# Altium schematic sheet EmergencyCaller.SchDoc
size A3
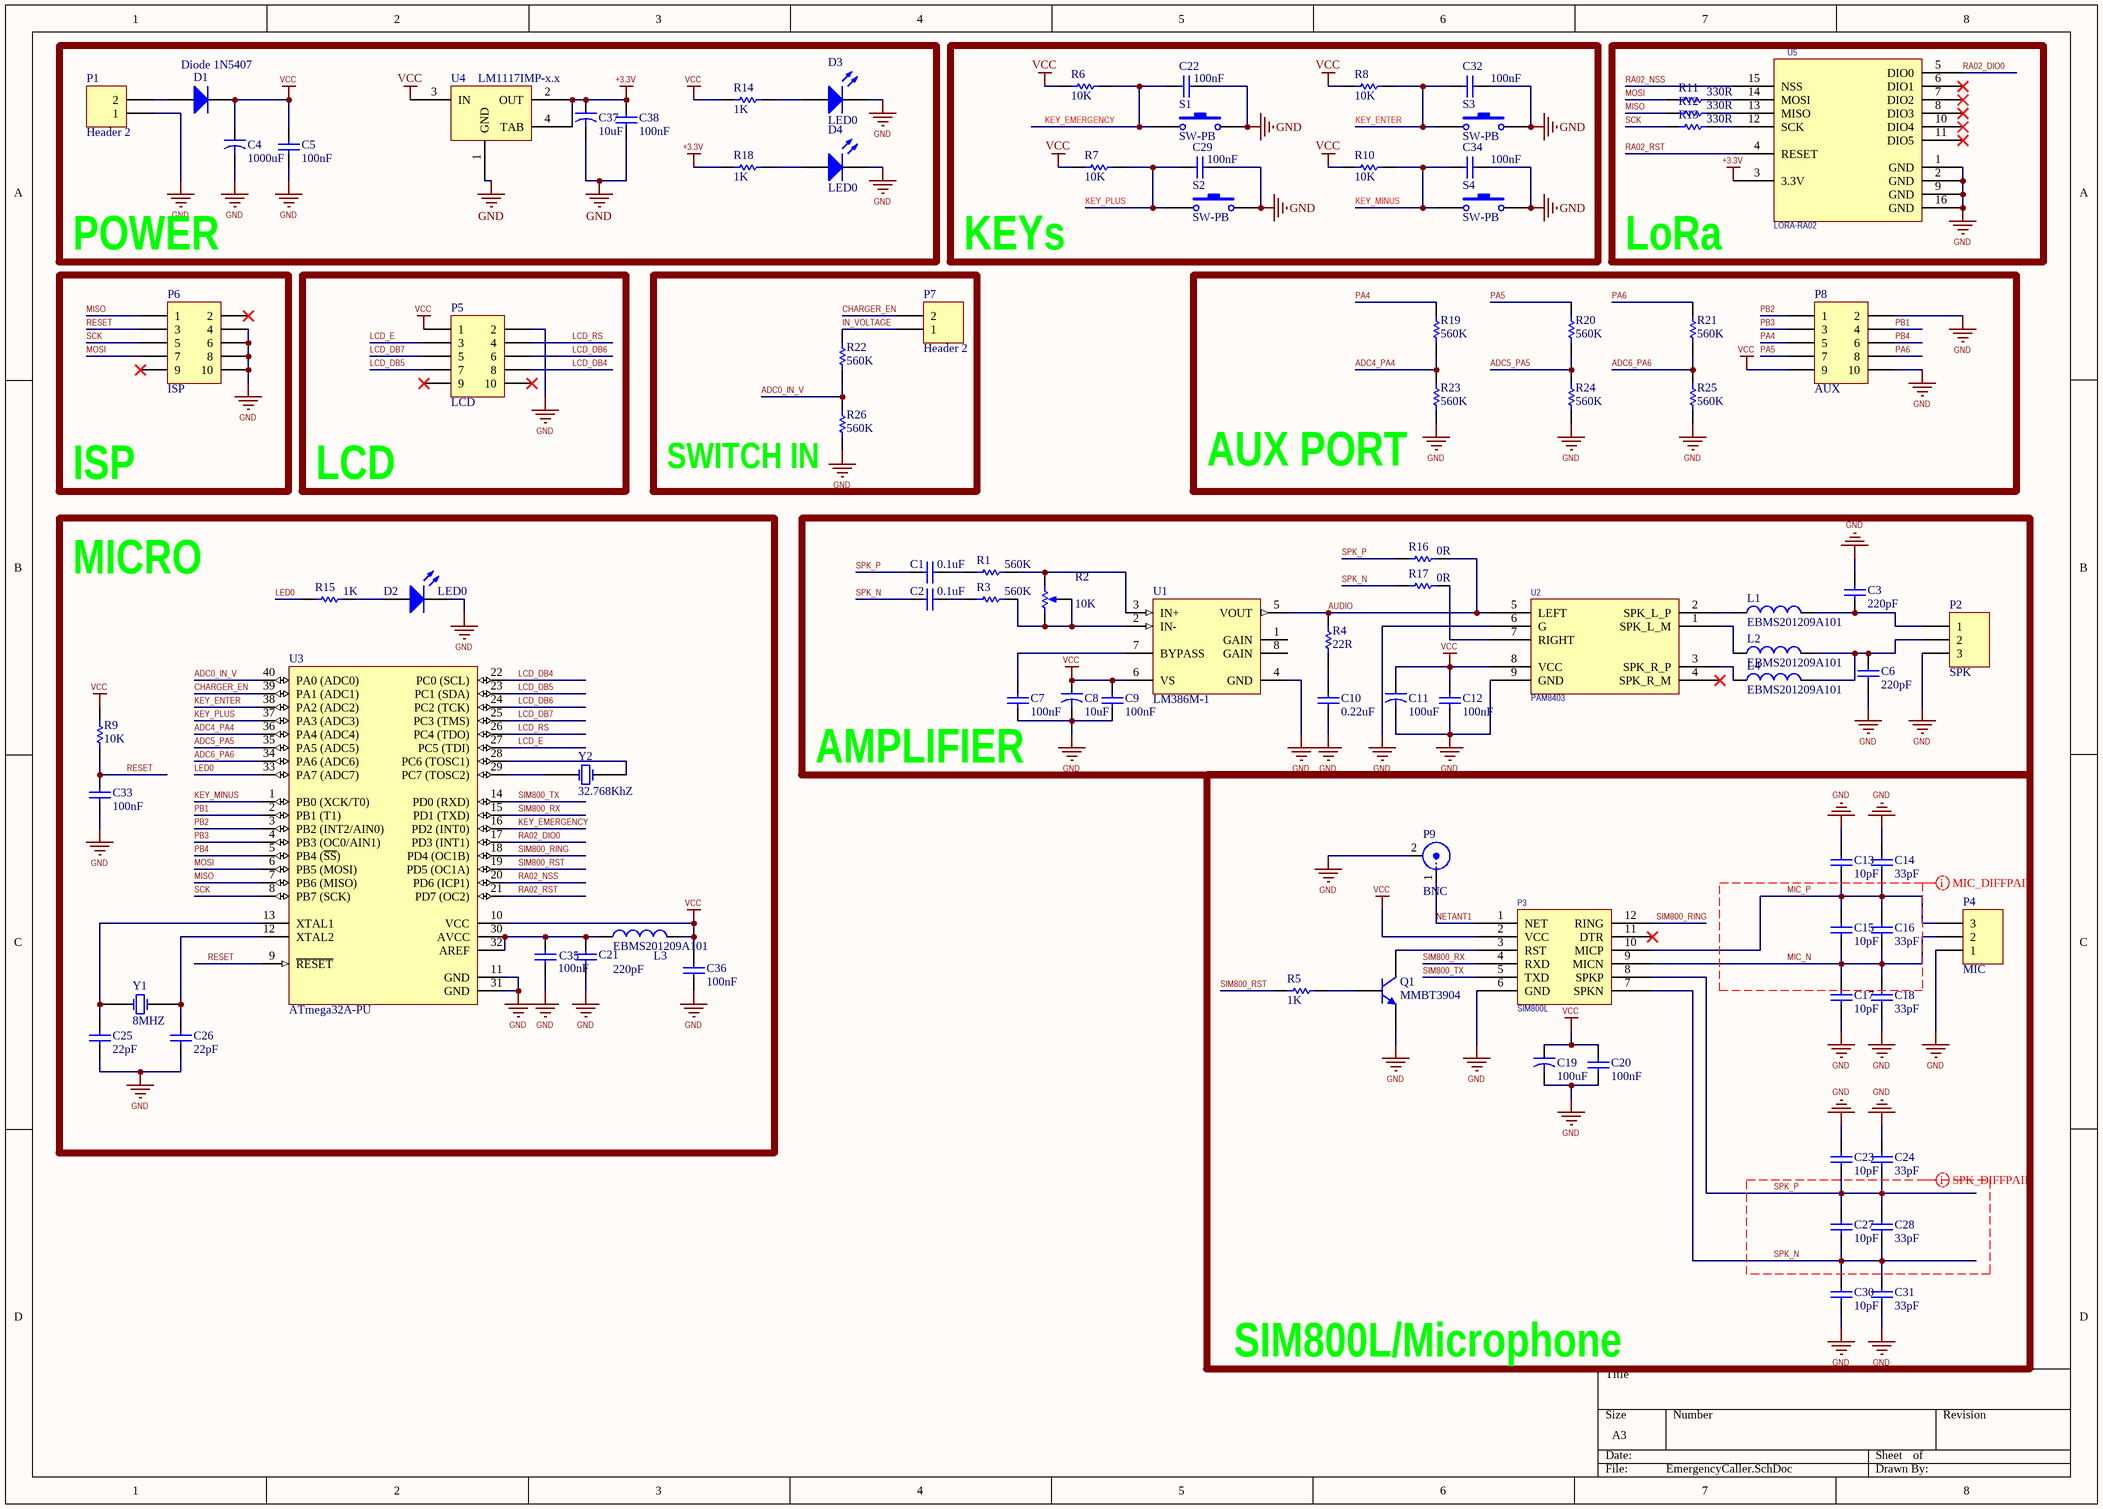
[diagram p0: EmergencyCaller.SchDoc]

## Parts
C1  0.1uF  [CAP0805]
C2  0.1uF  [CAP0805]
C3  220pF  [CAP0805]
C4  1000uF  [Cap electrolitic radial 10x16-5]
C5  100nF  [CAP0805]
C6  220pF  [CAP0805]
C7  100nF  [CAP0805]
C8  10uF  [Cap electrolitic radial 5x11-2]
C9  100nF  [CAP0805]
C10  0.22uF  [CAP0805]
C11  100uF  [Cap electrolitic radial 10x16-5]
C12  100nF  [CAP0805]
C13  10pF  [CAP0805]
C14  33pF  [CAP0805]
C15  10pF  [CAP0805]
C16  33pF  [CAP0805]
C17  10pF  [CAP0805]
C18  33pF  [CAP0805]
C19  100uF  [Cap electrolitic radial 10x16-5]
C20  100nF  [CAP0805]
C21  220pF  [CAP0805]
C22  value 100nF  [CAP0805]  (hidden comment: Cap)
C23  10pF  [CAP0805]
C24  33pF  [CAP0805]
C25  22pF  [CAP0805]
C26  22pF  [CAP0805]
C27  10pF  [CAP0805]
C28  33pF  [CAP0805]
C29  value 100nF  [CAP0805]  (hidden comment: Cap)
C30  10pF  [CAP0805]
C31  33pF  [CAP0805]
C32  value 100nF  [CAP0805]  (hidden comment: Cap)
C33  100nF  [CAP0805]
C34  value 100nF  [CAP0805]  (hidden comment: Cap)
C35  value 100nF  [CAP0805]  (hidden comment: Cap)
C36  100nF  [CAP0805]
C37  10uF  [Cap electrolitic radial 5x11-2]
C38  100nF  [CAP0805]
D1  Diode 1N5407  [1N5408 DO-201AD]
D2  LED0  [LED_0805]
D3  LED0  [LED_0805]
D4  LED0  [LED_0805]
L1  EBMS201209A101  [IND0805]
L2  EBMS201209A101  [IND0805]
L3  EBMS201209A101  [IND0805]
L4  EBMS201209A101  [IND0805]
P1  Header 2  [KF301 2PIN]
P2  SPK  [KF301 3PIN]
P3  SIM800L  [SIM800L_MODULE_DoublePin]
P4  MIC  [KF301 3PIN]
P5  LCD  [IDC2.54-10PIN]
P6  ISP  [IDC2.54-10PIN]
P7  Header 2  [KF301 2PIN]
P8  AUX  [HDR2x5]
P9  BNC  [SMA_RA_F]
Q1  MMBT3904  [SOT23_N]
R1  560K  [RES0805]
R2  value 10K  [MULTITURN_TRIMMER_3296]  (hidden comment: RPot)
R3  560K  [RES0805]
R4  22R  [RES0805]
R5  1K  [RES0805]
R6  value 10K  [RES0805]  (hidden comment: Res1)
R7  value 10K  [RES0805]  (hidden comment: Res1)
R8  value 10K  [RES0805]  (hidden comment: Res1)
R9  10K  [RES0805]
R10  value 10K  [RES0805]  (hidden comment: Res1)
R11  330R  [RES0805]
R12  330R  [RES0805]
R13  330R  [RES0805]
R14  1K  [RES0805]
R15  1K  [RES0805]
R16  0R  [RES0805]
R17  0R  [RES0805]
R18  1K  [RES0805]
R19  560K  [RES0805]
R20  560K  [RES0805]
R21  560K  [RES0805]
R22  560K  [RES0805]
R23  560K  [RES0805]
R24  560K  [RES0805]
R25  560K  [RES0805]
R26  560K  [RES0805]
S1  SW-PB  [KF301 2PIN]
S2  SW-PB  [SW-4PIN]
S3  SW-PB  [SW-4PIN]
S4  SW-PB  [SW-4PIN]
U1  LM386M-1  [SO-8N]
U2  PAM8403  [PAM8403_MODULE]
U3  ATmega32A-PU  [40P6]
U4  LM1117IMP-x.x  [SOT223_4]
U5  LORA-RA02  [RA02-LoRa-Module]
Y1  8MHZ  [CRYSTAL Small]
Y2  32.768KhZ  [Crystal_NC308]

## Blocks framed on the sheet
POWER: C4 C5 C37 C38 D1 D3 D4 P1 R14 R18 U4
LoRa: R11-R13 U5
LCD: P5
KEYs: P7 R22 R26
AUX PORT: P8 R19-R21 R23-R25
MICRO: C21 C25 C26 C33 C35 C36 D2 L3 R9 R15 U3 Y1 Y2
AMPLIFIER: C1-C3 C6-C12 L1 L2 L4 P2 R1-R4 R16 R17 U1 U2
SIM800L/Microphone: C13-C20 C23 C24 C27 C28 C30 C31 P3 P4 P9 Q1 R5

## Nets
+3.3V: C37.1 C38.2 R18.1 U4.2(OUT) U4.4(TAB) U5.3(3.3V)
GND: C3.1 C4.2 C5.1 C6.1 C7.1 C8.2 C9.1 C10.2 C11.2 C12.1 C13.2 C14.2 C17.1 C18.1 C19.2 C20.1 C21.2 C22.2 C23.2 C24.2 C25.2 C26.2 C29.2 C30.1 C31.1 C32.2 C33.1 C34.2 C35.1 C36.1 C37.2 C38.1 D2.2(K) D3.2(K) D4.2(K) P1.1 P2.3 P3.6(GND) P4.1 P5.2 P6.4 P6.6 P6.8 P6.10 P8.2 P8.10 P9.2(Y) Q1.2(E) R23.1 R24.1 R25.1 R26.1 S1.2 S2.2 S3.2 S4.2 U1.4(GND) U2.6(G) U2.9(GND) U3.11(GND) U3.31(GND) U4.1(GND) U5.1(GND) U5.2(GND) U5.9(GND) U5.16(GND)
VCC: C4.1 C5.2 C8.1 C9.2 C11.1 C12.2 C19.1 C20.2 C36.2 D1.2(K) L3.2 P3.2(VCC) P5.1 P8.9 R6.2 R7.2 R8.2 R9.2 R10.2 R14.1 U1.6(VS) U2.8(VCC) U3.10(VCC) U4.3(IN)
ADC0_IN_V: R22.1 R26.2 U3.40(PA0_(ADC0))
ADC4_PA4: R19.1 R23.2 U3.36(PA4_(ADC4))
ADC5_PA5: R20.1 R24.2 U3.35(PA5_(ADC5))
ADC6_PA6: R21.1 R25.2 U3.34(PA6_(ADC6))
AUDIO: R4.2 R16.1 U1.5(VOUT) U2.5(LEFT)
CHARGER_EN: P7.2 U3.39(PA1_(ADC1))
IN_VOLTAGE: P7.1 R22.2
KEY_EMERGENCY: C22.1 R6.1 S1.1 U3.16(PD2_(INT0))
KEY_ENTER: C32.1 R8.1 S3.1 U3.38(PA2_(ADC2))
KEY_MINUS: C34.1 R10.1 S4.1 U3.1(PB0_(XCK/T0))
KEY_PLUS: C29.1 R7.1 S2.1 U3.37(PA3_(ADC3))
LCD_DB4: P5.8 U3.22(PC0_(SCL))
LCD_DB5: P5.7 U3.23(PC1_(SDA))
LCD_DB6: P5.6 U3.24(PC2_(TCK))
LCD_DB7: P5.5 U3.25(PC3_(TMS))
LCD_E: P5.3 U3.27(PC5_(TDI))
LCD_RS: P5.4 U3.26(PC4_(TDO))
LED0: R15.1 U3.33(PA7_(ADC7))
MIC_N: C15.1 C16.1 C17.2 C18.2 P3.9(MICN) P4.2
MIC_P: C13.1 C14.1 C15.2 C16.2 P3.10(MICP) P4.3
MISO: P6.1 R12.2 U3.7(PB6_(MISO))
MOSI: P6.7 R11.2 U3.6(PB5_(MOSI))
NETANT1: P3.1(NET) P9.1(X)
PA4: P8.5 R19.2
PA5: P8.7 R20.2
PA6: P8.8 R21.2
PB1: P8.4 U3.2(PB1_(T1))
PB2: P8.1 U3.3(PB2_(INT2/AIN0))
PB3: P8.3 U3.4(PB3_(OC0/AIN1))
PB4: P8.6 U3.5(PB4_(~{SS}))
RA02_DIO0: U3.17(PD3_(INT1)) U5.5(DIO0)
RA02_NSS: U3.20(PD6_(ICP1)) U5.15(NSS)
RA02_RST: U3.21(PD7_(OC2)) U5.4(RESET)
RESET: C33.2 P6.3 R9.1 U3.9(~{RESET})
SCK: P6.5 R13.2 U3.8(PB7_(SCK))
SIM800_RING: P3.12(RING) U3.18(PD4_(OC1B))
SIM800_RST: R5.1 U3.19(PD5_(OC1A))
SIM800_RX: P3.4(RXD) U3.15(PD1_(TXD))
SIM800_TX: P3.5(TXD) U3.14(PD0_(RXD))
SPK_N: C2.2 C27.1 C28.1 C30.2 C31.2 P3.7(SPKN) R17.2
SPK_P: C1.2 C23.1 C24.1 C27.2 C28.2 P3.8(SPKP) R16.2
NetC1_1: C1.1 R1.1
NetC2_1: C2.1 R3.1
NetC3_2: C3.2 L1.2 P2.1
NetC6_2: C6.2 L2.2 L4.2 P2.2
NetC7_2: C7.2 U1.7(BYPASS)
NetC10_1: C10.1 R4.1
NetC21_1: C21.1 C35.2 L3.1 U3.30(AVCC) U3.32(AREF)
NetC25_1: C25.1 U3.13(XTAL1) Y1.2(OSC2)
NetC26_1: C26.1 U3.12(XTAL2) Y1.1(OSC1)
NetD1_1: D1.1(A) P1.2
NetD2_1: D2.1(A) R15.2
NetD3_1: D3.1(A) R14.2
NetD4_1: D4.1(A) R18.2
NetL1_1: L1.1 U2.2(SPK_L_P)
NetL2_1: L2.1 U2.1(SPK_L_M)
NetL4_1: L4.1 U2.3(SPK_R_P)
NetP3_3: P3.3(RST) Q1.3(C)
NetQ1_1: Q1.1(B) R5.2
NetR1_2: R1.2 R2.3(BOT) U1.3(IN+)
NetR2_1: R2.1(TOP) R2.2(TAP) R3.2 U1.2(IN-)
NetR11_1: R11.1 U5.14(MOSI)
NetR12_1: R12.1 U5.13(MISO)
NetR13_1: R13.1 U5.12(SCK)
NetR17_1: R17.1 U2.7(RIGHT)
NetU3_28: U3.28(PC6_(TOSC1)) Y2.2(OSC2)
NetU3_29: U3.29(PC7_(TOSC2)) Y2.1(OSC1)

Not connected (* = marked no-connect by the designer): P3 11(DTR)*; P5 9* 10*; P6 2* 9*; U1 1(GAIN) 8(GAIN); U2 4(SPK_R_M)*; U5 6(DIO1)* 7(DIO2)* 8(DIO3)* 10(DIO4)* 11(DIO5)*

## Layout directives
differential pair: MIC_N, MIC_P, SPK_N, SPK_P

## Notes on the sheet
- ISP
- (near R26) SWITCH IN

## Library data of the parts
C1-C3 C5-C7 C9 C10 C12-C18 C20-C36 C38 = Cap: Capacitor; Published: 8-Jun-2000; LatestRevisionDate: 17-Jul-2002; LatestRevisionNote: Re-released for DXP Platform.; PackageReference: RAD-0.3; Publisher: Altium Limited; PackageDescription: Radial Cap, Thru-Hole; 2 Leads; 0.3 in Pin Spacing
  C1 C2: Value: 0.1uF
  C3 C6 C21: Value: 220pF
  C5 C7 C9 C12 C20 C33 C36 C38: Value: 100nF
  C10: Value: 0.22uF
  C13 C15 C17 C23 C27 C30: Value: 10pF
  C14 C16 C18 C24 C28 C31: Value: 33pF
  C25 C26: Value: 22pF
C4 C8 C11 C19 C37 = Cap2: Capacitor; Published: 23-Sep-2002; PackageReference: CAPR5-4X5; Publisher: Altium Limited; PackageDescription: Capacitor; 2 Leads
  C4: Value: 1000uF
  C8 C37: Value: 10uF
  C11 C19: Value: 100uF
D1 = Diode 1N5407: 3 Amp Medium Power Silicon Rectifier Diode; Published: 8-Jun-2000; LatestRevisionDate: 17-Jul-2002; LatestRevisionNote: Re-released for DXP Platform.; DatasheetVersion: Aug-1984; PackageReference: DO-201AD; Publisher: Altium Limited; PackageDescription: Diode, Axial; Body 9.5 x 5.3 mm (LxDia. max), Lead Dia. 1.32 mm (max); ComponentLink1Description: Manufacturer Link; ComponentLink1URL: http://www.irf.com/
D2-D4 = LED0: Typical INFRARED GaAs LED; Published: 8-Jun-2000; LatestRevisionDate: 08-Jul-2005; LatestRevisionNote: Mech Layer 1 removed.; PackageReference: LED-0; Publisher: Altium Limited; PackageDescription: LED; 2 Leads
L1-L4 = Inductor: Code_IEC: 1005; Value: 10mH; Published: 8-Jun-2000; LatestRevisionDate: 29-May-2009; LatestRevisionNote: IPC-7351 Footprint Added.; PackageReference: 0402-A; Publisher: Altium Limited; PackageDescription: Chip Inductor; Code_JEITA: 0402
P1 P7 = Header 2: Header, 2-Pin; LatestRevisionDate: 17-Jul-2002; LatestRevisionNote: Re-released for DXP Platform.; Publisher: Altium Limited
P2 P4 = Header 3: Header, 3-Pin; LatestRevisionDate: 17-Jul-2002; LatestRevisionNote: Re-released for DXP Platform.; Publisher: Altium Limited
P3 = sim800L_Module: Header, 2-Pin; LatestRevisionDate: 17-Jul-2002; LatestRevisionNote: Re-released for DXP Platform.; Publisher: Altium Limited
P5 P6 P8 = Header 5X2: Header, 5-Pin, Dual row; LatestRevisionDate: 17-Jul-2002; LatestRevisionNote: Re-released for DXP Platform.; Publisher: Altium Limited
P9 = BNC: BNC Elbow Connector; LatestRevisionDate: 17-Jul-2002; LatestRevisionNote: Re-released for DXP Platform.; Publisher: Altium Limited
Q1 = MMBT3904: NPN Switching Transistor; Published: 17-Sep-2003; LatestRevisionDate: 12-Dec-2006; LatestRevisionNote: IPC-7351 Footprint Added.; DatasheetVersion: 13-May-2002; PackageVersion: May-1999; PackageReference: SOT23; Publisher: Altium Limited; PackageDescription: 3-Pin SOT-23 Package 0.95 mm Pitch, 2.3 mm Lead Span; ComponentLink1Description: Manufacturer Link; ComponentLink1URL: http://www.semiconductors.philips.com/; ComponentLink2Description: Datasheet; ComponentLink2URL: http://www.semiconductors.philips.com/acrobat/datasheets/MMBT3904_4.pdf
R1 R3-R26 = Res1: Resistor; Published: 8-Jun-2000; LatestRevisionDate: 17-Jul-2002; LatestRevisionNote: Re-released for DXP Platform.; PackageReference: AXIAL-0.3; Publisher: Altium Limited; PackageDescription: Axial Device, Thru-Hole; 2 Leads; 0.3 in Pin Spacing
  R1 R3 R19-R26: Value: 560K
  R4: Value: 22R
  R5 R14 R15 R18: Value: 1K
  R9: Value: 10K
  R11-R13: Value: 330R
  R16 R17: Value: 0R
R2 = RPot: Potentiometer; Sim Note: Enter the Resistance value and the set point into parameter fields.; Set Position: 0.5; Published: 8-Jun-2000; LatestRevisionDate: 17-Jul-2002; LatestRevisionNote: Re-released for DXP Platform.; PackageReference: VR5; Publisher: Altium Limited; PackageDescription: Variable Resistor, Thru-Hole; 3 Leads
S1-S4 = SW-PB: Switch; Published: 24-Mar-1999; LatestRevisionDate: 17-Jul-2002; LatestRevisionNote: Re-released for DXP Platform.; PackageReference: SPST-2; Publisher: Altium Limited; PackageDescription: Switch; 2 Leads
U1 = LM386M-1: Low Voltage Audio Power Amplifier, 8-pin Narrow SOIC; Manufacturer: National Semiconductor; PackageTopMarking: NSZXTT*LM386*M-1; PowerWise: N; CompType: Audio IC; Published: 4-Dec-2008; DatasheetVersion: Aug-2000; PackageVersion: revM, May-2009; PackageReference: M08A; Publisher: Altium Limited; PackageDescription: SOIC Narrow, 4.9 x 3.9 x 1.45mm, 8 Lead, 1.27mm Pitch; Supplier 1: Farnell; Supplier Part Number 1: 9488324; PartNumber: LM386M-1; RoHS: N; PinCount: 8; Code_JEDEC: MS-012-AA; Code_IPC: SOIC127P600-8; ComponentLink1Description: LM386 Datasheet; ComponentLink1URL: http://www.national.com/ds/LM/LM386.pdf; ComponentLink2Description: LM386 Web Page; ComponentLink2URL: http://www.national.com/pf/LM/LM386.html; ComponentLink3Description: M08A Package Page; ComponentLink3URL: http://www.national.com/packaging/folders/m08a.html
U2 = PAM8403_Module: FILTERLESS 3W CLASS-D STEREO AUDIO AMPLIFIER; LatestRevisionDate: 17-Jul-2002; LatestRevisionNote: Re-released for DXP Platform.; Publisher: Altium Limited
U3 = ATmega32A-PU: 8-bit AVR Microcontroller, 32KB Flash, 1KB EEPROM, 2KB SRAM, 40-pin PDIP, Industrial Grade (-40°C to 85°C); Published: 1-Apr-2010; DatasheetVersion: revB, Jul-2009; PackageVersion: revB, Sep-2001; PackageReference: 40P6; Publisher: Altium Limited; PackageDescription: 40-lead (0.600"/15.24mm Wide) Plastic Dual Inline Package (PDIP); Supplier 1: Digi-Key; Supplier Part Number 1: ATMEGA32A-PU-ND; Supplier 2: Farnell; Supplier Part Number 2: 1704565; Supplier 3: Mouser; Supplier Part Number 3: 556-ATMEGA32A-PU; Code_JEDEC: MS-011-AC; ComponentLink1Description: Manufacturer Link; ComponentLink1URL: http://www.atmel.com/products/avr/default.asp?; ComponentLink2Description: ATmega32A Datasheet; ComponentLink2URL: http://www.atmel.com/dyn/resources/prod_documents/doc8155.pdf; ComponentLink3Description: ATmega32A Summary; ComponentLink3URL: http://www.atmel.com/dyn/resources/prod_documents/8155S.pdf; ComponentLink4Description: Atmel.com Home; ComponentLink4URL: http://www.atmel.com
U4 = LM1117IMP-x.x: x.x Volt, 800mA Low-Dropout Linear Regulator, 4-pin SOT-223; Designer: Abbas Basereh; Data: 16-12-2016; VALUE: LM1117IMP-x.x
U5 = LORA-RA02: sx1278  Low Power Long Range Transceiver; LatestRevisionDate: 17-Jul-2002; LatestRevisionNote: Re-released for DXP Platform.; Publisher: Altium Limited
Y1 = XTAL_Crystal: XTAL Crystal; Designer: ABBAS BASEREH; Design Date: 2017-1-3; ComponentLink1Description: Datasheet; ComponentLink2Description: Reference; Mounting Technology: Surface Mount\Through-Hole; Value: 8MHZ; Status: Unreleased
Y2 = XTAL_Crystal: XTAL Crystal; Designer: ABBAS BASEREH; Value: 8MHZ; Design Date: 2017-1-3; ComponentLink1Description: Datasheet; ComponentLink2Description: Reference; Mounting Technology: Surface Mount\Through-Hole; Status: Unreleased